# Altium schematic sheet IF_TX.SchDoc: {Наименование}
size 420 x 297 mm; DocumentNumber: ПЛАС.ХХХХХХ.ХХХ ХХ; SheetNumber: {}; SheetTotal: {}; PageSetup: Record=PageOptions|CenterHorizontal=False|CenterVertical=False|PrintScale=0.95|XCorrection=0.00|YCorrection=0.00|PrintKind=1|BorderSize=5000000|LeftOffset=0|BottomOffset=0|Orientation=1|PaperLength=1000|PaperWidth=1000|Scale=100|PaperSource=15|PrintQuality=600|MediaType=1|DitherType=10|PaperKind=A4|PrintScaleMode=1; Rule: PcbType=ProtelPcb
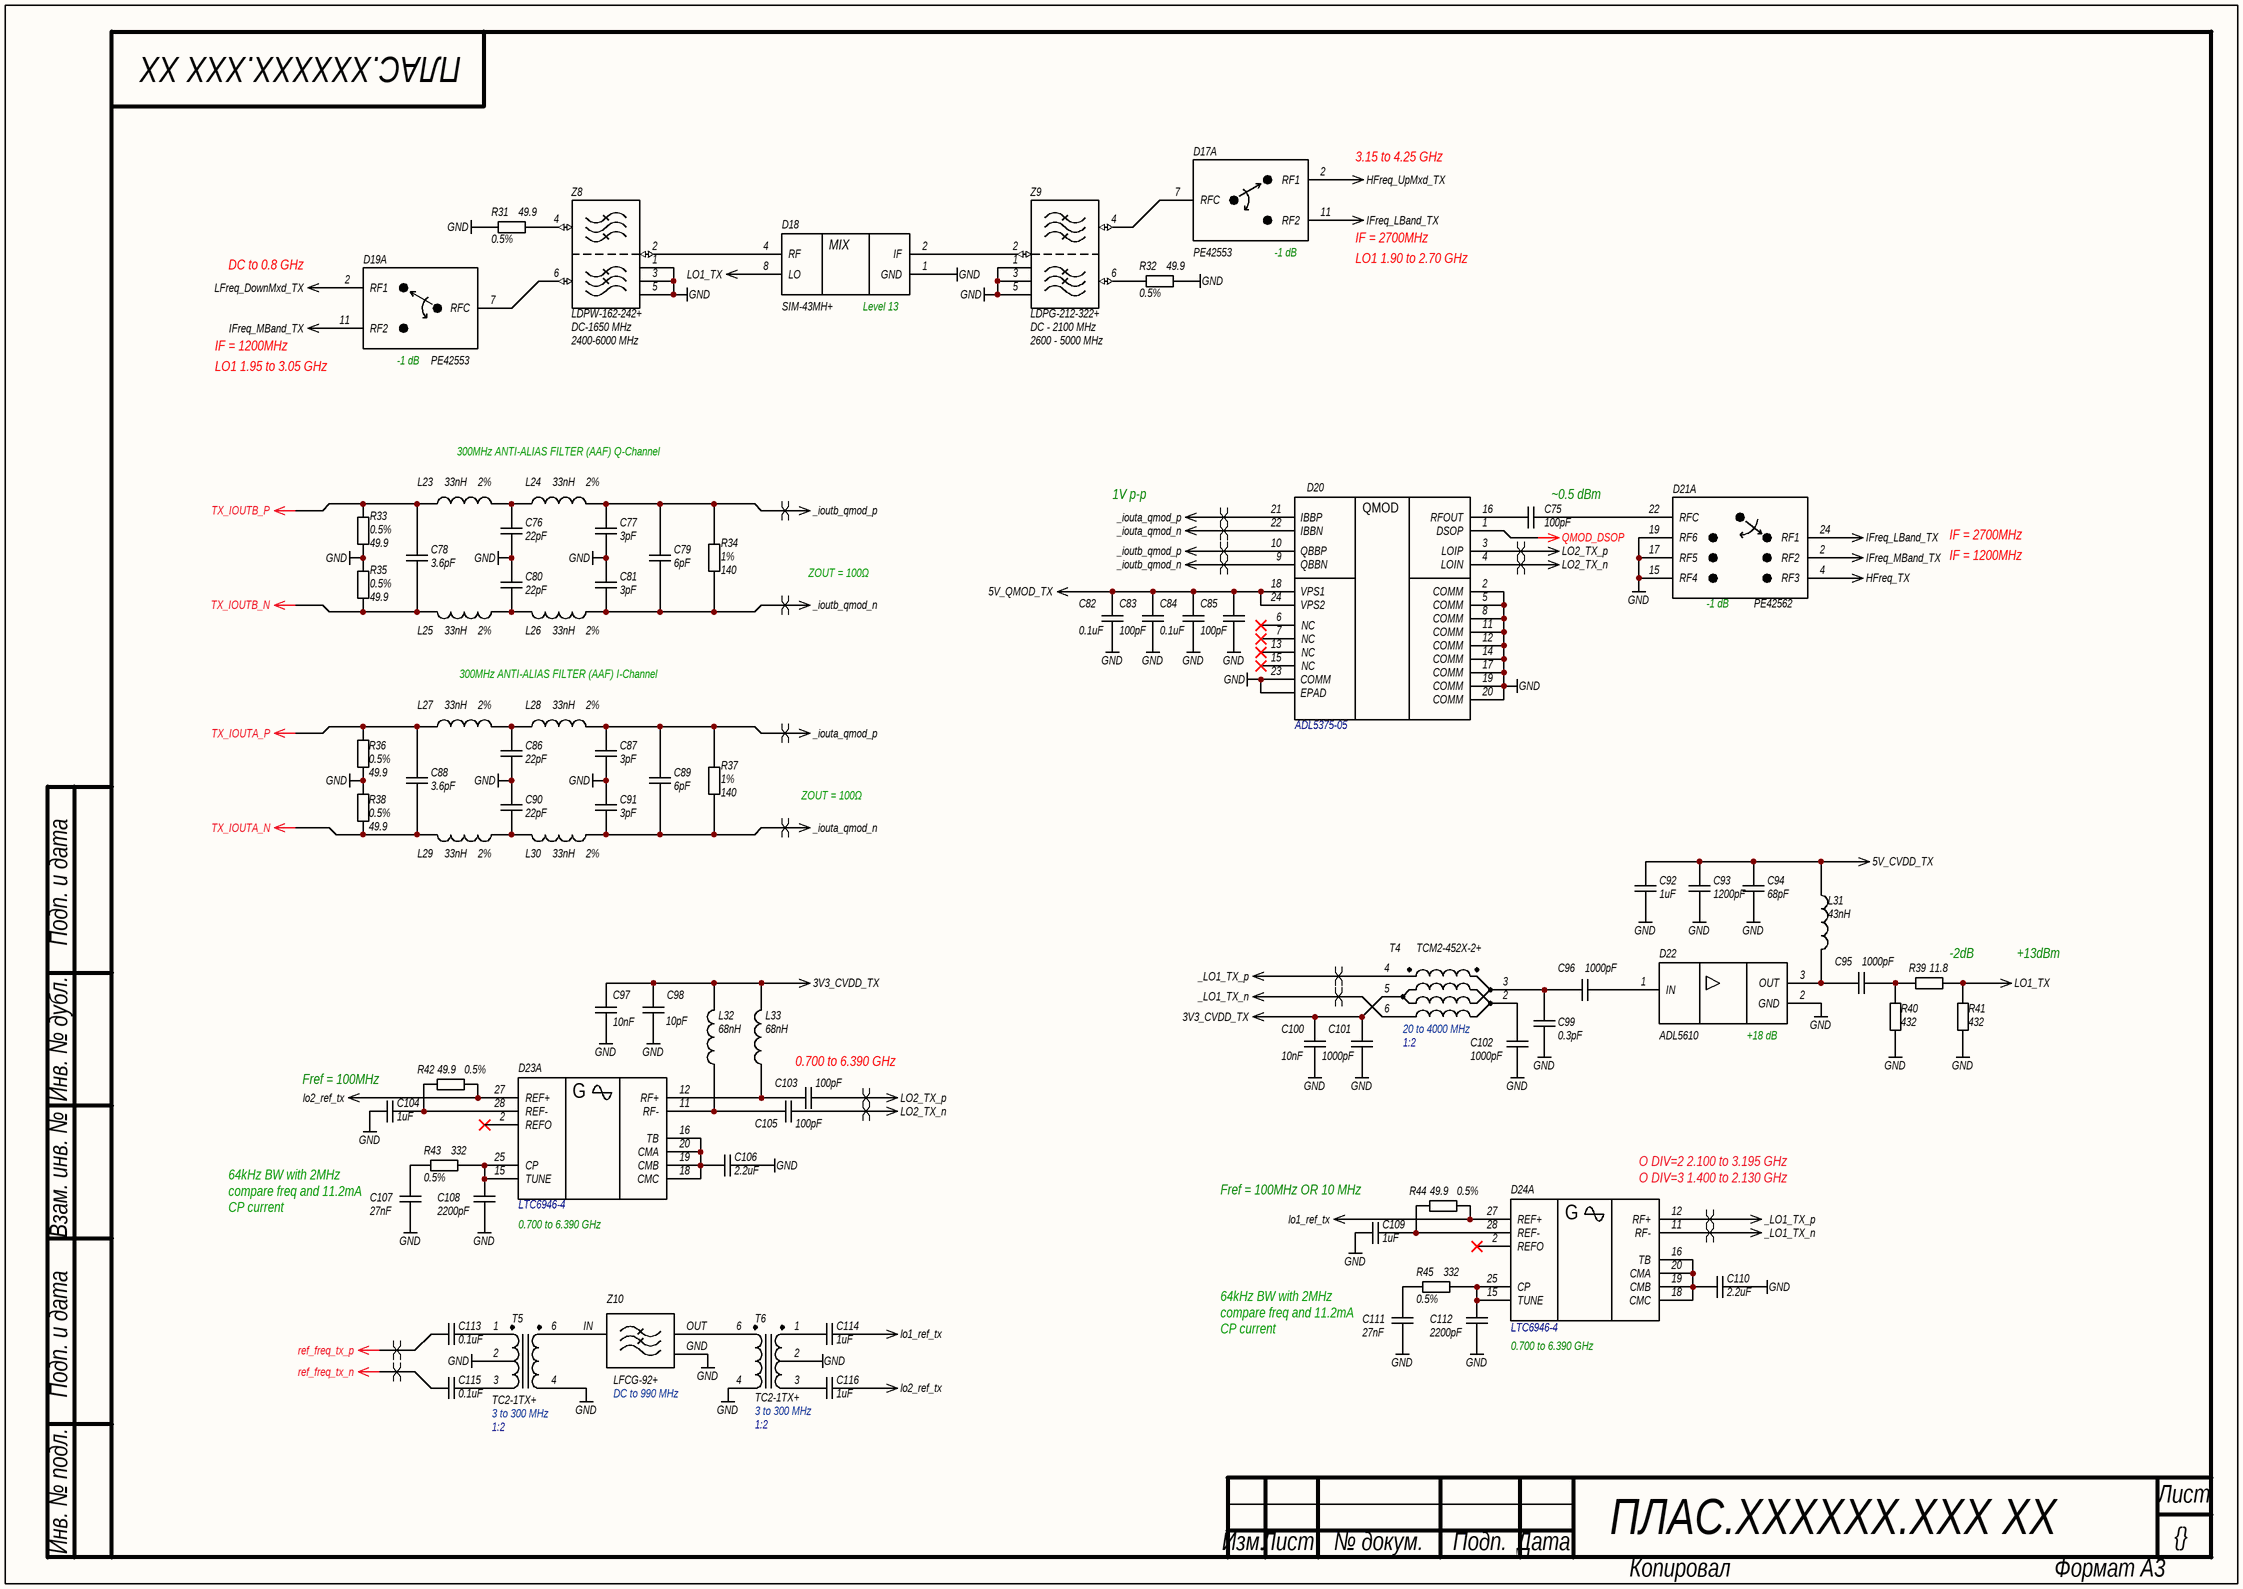
[diagram p0: IF_TX.SchDoc]

## Parts
C75  value 100pF  [C0402]  (hidden comment: CAP)
C76  value 22pF  [C0402]  (hidden comment: CAP)
C77  value 3pF  [C0402]  (hidden comment: CAP)
C78  value 3.6pF  [C0402]  (hidden comment: CAP)
C79  value 6pF  [C0402]  (hidden comment: CAP)
C80  value 22pF  [C0402]  (hidden comment: CAP)
C81  value 3pF  [C0402]  (hidden comment: CAP)
C82  value 0.1uF  [C0402]  (hidden comment: CAP)
C83  value 100pF  [C0402]  (hidden comment: CAP)
C84  value 0.1uF  [C0402]  (hidden comment: CAP)
C85  value 100pF  [C0402]  (hidden comment: CAP)
C86  value 22pF  [C0402]  (hidden comment: CAP)
C87  value 3pF  [C0402]  (hidden comment: CAP)
C88  value 3.6pF  [C0402]  (hidden comment: CAP)
C89  value 6pF  [C0402]  (hidden comment: CAP)
C90  value 22pF  [C0402]  (hidden comment: CAP)
C91  value 3pF  [C0402]  (hidden comment: CAP)
C92  value 1uF  [C0805]  (hidden comment: CAP)
C93  value 1200pF  [C0603]  (hidden comment: CAP)
C94  value 68pF  [C0402]  (hidden comment: CAP)
C95  value 1000pF  [C0402]  (hidden comment: CAP)
C96  value 1000pF  [C0402]  (hidden comment: CAP)
C97  value 10nF  [C0402]  (hidden comment: CAP)
C98  value 10pF  [C0402]  (hidden comment: CAP)
C99  value 0.3pF  [C0402]  (hidden comment: CAP)
C100  value 10nF  [C0402]  (hidden comment: CAP)
C101  value 1000pF  [C0402]  (hidden comment: CAP)
C102  value 1000pF  [C0402]  (hidden comment: CAP)
C103  value 100pF  [C0402]  (hidden comment: CAP)
C104  value 1uF  [C0805]  (hidden comment: CAP)
C105  value 100pF  [C0402]  (hidden comment: CAP)
C106  value 2.2uF  [C0603]  (hidden comment: CAP)
C107  value 27nF  [C1206]  (hidden comment: CAP)
C108  value 2200pF  [C0603]  (hidden comment: CAP)
C109  value 1uF  [C0805]  (hidden comment: CAP)
C110  value 2.2uF  [C0603]  (hidden comment: CAP)
C111  value 27nF  [C1206]  (hidden comment: CAP)
C112  value 2200pF  [C0603]  (hidden comment: CAP)
C113  value 0.1uF  [C0402]  (hidden comment: CAP)
C114  value 1uF  [C0805]  (hidden comment: CAP)
C115  value 0.1uF  [C0402]  (hidden comment: CAP)
C116  value 1uF  [C0805]  (hidden comment: CAP)
D17  PE42553  [QFN-16]  (part A of 2)
D18  SIM-43MH+  [SIM-43MH+]
D19  PE42553  [QFN-16]  (part A of 2)
D20  Name: ADL5375-05  [LFCSP-24]  (hidden comment: ADL5375)
D21  PE42562  [QFN-24]  (part A of 2)
D22  ADL5610  [ADL5610]
D23  Name: LTC6946-4  Frequency Range: 0.700 to 6.390 GHz  [QFN-28]  (hidden comment: LTC6946)  (part A of 2)
D24  Name: LTC6946-4  Frequency Range: 0.700 to 6.390 GHz  [QFN-28]  (hidden comment: LTC6946)  (part A of 2)
L23  value 33nH  Tolerance: 2%  [L0603_HP]  (hidden comment: Inductor RF)
L24  value 33nH  Tolerance: 2%  [L0603_HP]  (hidden comment: Inductor RF)
L25  value 33nH  Tolerance: 2%  [L0603_HP]  (hidden comment: Inductor RF)
L26  value 33nH  Tolerance: 2%  [L0603_HP]  (hidden comment: Inductor RF)
L27  value 33nH  Tolerance: 2%  [L0603_HP]  (hidden comment: Inductor RF)
L28  value 33nH  Tolerance: 2%  [L0603_HP]  (hidden comment: Inductor RF)
L29  value 33nH  Tolerance: 2%  [L0603_HP]  (hidden comment: Inductor RF)
L30  value 33nH  Tolerance: 2%  [L0603_HP]  (hidden comment: Inductor RF)
L31  value 43nH  [L0603_HP]  (hidden comment: Inductor RF)
L32  value 68nH  [L0603_HP]  (hidden comment: Inductor RF)
L33  value 68nH  [L0603_HP]  (hidden comment: Inductor RF)
R31  value 49.9  Tolerance: 0.5%  [R0402]  (hidden comment: RES)
R32  value 49.9  Tolerance: 0.5%  [R0402]  (hidden comment: RES)
R33  value 49.9  Tolerance: 0.5%  [R0402]  (hidden comment: RES)
R34  value 140  Tolerance: 1%  [R0402]  (hidden comment: RES)
R35  value 49.9  Tolerance: 0.5%  [R0402]  (hidden comment: RES)
R36  value 49.9  Tolerance: 0.5%  [R0402]  (hidden comment: RES)
R37  value 140  Tolerance: 1%  [R0402]  (hidden comment: RES)
R38  value 49.9  Tolerance: 0.5%  [R0402]  (hidden comment: RES)
R39  value 11.8  [R0402]  (hidden comment: RES)
R40  value 432  [R0402]  (hidden comment: RES)
R41  value 432  [R0402]  (hidden comment: RES)
R42  value 49.9  Tolerance: 0.5%  [R0402]  (hidden comment: RES)
R43  value 332  Tolerance: 0.5%  [R0603]  (hidden comment: RES)
R44  value 49.9  Tolerance: 0.5%  [R0402]  (hidden comment: RES)
R45  value 332  Tolerance: 0.5%  [R0603]  (hidden comment: RES)
T4  TCM2-452X-2+  Frequency: 20 to 4000 MHz  Ratio: 1:2  [DB1627]
T5  TC2-1TX+  Frequency: 3 to 300 MHz  Ratio: 1:2  [AT1521]
T6  TC2-1TX+  Frequency: 3 to 300 MHz  Ratio: 1:2  [AT1521]
Z8  LDPW-162-242+  Low Pass: DC-1650 MHz  High Pass: 2400-6000 MHz  [JC0603C]
Z9  LDPG-212-322+  Low Pass: DC - 2100 MHz  High Pass: 2600 - 5000 MHz  [GE0805C-10]
Z10  LFCG-92+  Frequency: DC to 990 MHz  [GE0805C-2]

## Nets
3V3_CVDD_TX: C97.2 C98.2 C100.2 C101.1 L32.2 L33.2 T4.5
5V_CVDD_TX: C92.1 C93.2 C94.2 L31.2
5V_QMOD_TX: C82.2 C83.2 C84.2 C85.2 D20.18(VPS1) D20.24(VPS2)
_iouta_qmod_n: C89.2 C91.2 D20.22(IBBN) L30.2 R37.2
_iouta_qmod_p: C87.1 C89.1 D20.21(IBBP) L28.2 R37.1
_ioutb_qmod_n: C79.2 C81.2 D20.9(QBBN) L26.2 R34.2
_ioutb_qmod_p: C77.1 C79.1 D20.10(QBBP) L24.2 R34.1
_LO1_TX_n: D24.11(RF-) T4.6
_LO1_TX_p: D24.12(RF+) T4.4
GND: C76.2 C77.2 C80.1 C81.1 C82.1 C83.1 C84.1 C85.1 C86.2 C87.2 C90.1 C91.1 C92.2 C93.1 C94.1 C97.1 C98.1 C99.1 C100.1 C101.2 C102.2 C104.2 C106.1 C107.1 C108.1 C109.2 C110.1 C111.1 C112.1 D18.1(GND) D20.2(COMM) D20.5(COMM) D20.8(COMM) D20.11(COMM) D20.12(COMM) D20.14(COMM) D20.17(COMM) D20.19(COMM) D20.20(COMM) D20.23(COMM) D20.25(EPAD) D21.15(RF4) D21.17(RF5) D21.19(RF6) D22.2(GND) R31.1 R32.1 R33.2 R35.1 R36.2 R38.1 R40.2 R41.2 T5.2 T5.4 T6.2 T6.4 Z8.1(GND) Z8.3(GND) Z8.5(GND) Z9.1(GND) Z9.3(GND) Z9.5(GND) Z10.GND
HFreq_TX: D21.4(RF3)
HFreq_UpMxd_TX: D17.2(RF1)
IFreq_LBand_TX: D17.11(RF2) D21.24(RF1)
IFreq_MBand_TX: D19.11(RF2) D21.2(RF2)
LFreq_DownMxd_TX: D19.2(RF1)
lo1_ref_tx: C114.1 D24.27(REF+) R44.1
LO1_TX: D18.8(LO) R39.1 R41.1
lo2_ref_tx: C116.1 D23.27(REF+) R42.1
LO2_TX_n: C105.2 D20.4(LOIN)
LO2_TX_p: C103.2 D20.3(LOIP)
QMOD_DSOP: D20.1(DSOP)
ref_freq_tx_n: C115.2
ref_freq_tx_p: C113.2
TX_IOUTA_N: C88.2 L29.1 R38.2
TX_IOUTA_P: C88.1 L27.1 R36.1
TX_IOUTB_N: C78.2 L25.1 R35.2
TX_IOUTB_P: C78.1 L23.1 R33.1
NetC75_1: C75.1 D20.16(RFOUT)
NetC75_2: C75.2 D21.22(RFC)
NetC76_1: C76.1 L23.2 L24.1
NetC80_2: C80.2 L25.2 L26.1
NetC86_1: C86.1 L27.2 L28.1
NetC90_2: C90.2 L29.2 L30.1
NetC95_1: C95.1 D22.3(OUT) L31.1
NetC95_2: C95.2 R39.2 R40.1
NetC96_1: C96.1 C99.2 T4.3
NetC96_2: C96.2 D22.1(IN)
NetC102_1: C102.1 T4.2
NetC103_1: C103.1 D23.12(RF+) L33.1
NetC104_1: C104.1 D23.28(REF-) R42.2
NetC105_1: C105.1 D23.11(RF-) L32.1
NetC106_2: C106.2 D23.16(TB) D23.18(CMC) D23.19(CMB) D23.20(CMA)
NetC107_2: C107.2 R43.2
NetC108_2: C108.2 D23.15(TUNE) D23.25(CP) R43.1
NetC109_1: C109.1 D24.28(REF-) R44.2
NetC110_2: C110.2 D24.16(TB) D24.18(CMC) D24.19(CMB) D24.20(CMA)
NetC111_2: C111.2 R45.2
NetC112_2: C112.2 D24.15(TUNE) D24.25(CP) R45.1
NetC113_1: C113.1 T5.1
NetC114_2: C114.2 T6.1
NetC115_1: C115.1 T5.3
NetC116_2: C116.2 T6.3
NetD17_7: D17.7(RFC) Z9.4
NetD18_2: D18.2(IF) Z9.2
NetD18_4: D18.4(RF) Z8.2
NetD19_7: D19.7(RFC) Z8.6
NetR31_2: R31.2 Z8.4
NetR32_2: R32.2 Z9.6
NetT5_6: T5.6 Z10.IN
NetT6_6: T6.6 Z10.OUT

Not connected (* = marked no-connect by the designer): D20 6(NC)* 7(NC)* 13(NC)* 15(NC)*; D23 2(REFO)*; D24 2(REFO)*

## Layout directives
differential pair: _iouta_qmod_n, _iouta_qmod_p, _ioutb_qmod_n, _ioutb_qmod_p, _LO1_TX_n, _LO1_TX_p, LO2_TX_n, LO2_TX_p, ref_freq_tx_n, ref_freq_tx_p

## Notes on the sheet
- (near D17) 3.15 to 4.25 GHz
- (near D17) IF = 2700MHz
- LO1 1.90 to 2.70 GHz
- (near D19) DC to 0.8 GHz
- IF = 1200MHz
- (near D19) LO1 1.95 to 3.05 GHz
- 300MHz ANTI-ALIAS FILTER (AAF) Q-Channel
- 1V p-p
- (near C75) ~0.5 dBm
- ZOUT = 100Ω
- IF = 2700MHz
- 300MHz ANTI-ALIAS FILTER (AAF) I-Channel
- (near R39) -2dB
- +13dBm
- 0.700 to 6.390 GHz
- (near C104) Fref = 100MHz
- Fref = 100MHz OR 10 MHz
- (near D24) O DIV=2 2.100 to 3.195 GHz
  O DIV=3 1.400 to 2.130 GHz
- 64kHz BW with 2MHz compare freq and 11.2mA CP current
- Подп. и дата
- Инв. № дубл.
- Взам. инв. №
- Инв. № подл.
- Лист
- Изм.
- № докум.
- Подп.
- Дата
- Копировал
- Формат А3
- (in symbol ADL5375) QMOD
- (in symbol ADL5610) +18 dB
- (in symbol LTC6946, part A) G
- (in symbol PE42553, part A) -1 dB
- (in symbol PE42562, part A) -1 dB
- (in symbol SIM-43MH+) MIX; Level 13

## Library data of the parts
C75 C83 C85 C103 C105 = CAP: SMD Capacitor; Manufacturer: Murata; Material: NP0; Tolerance: 1%; Voltage: 50V; Type: Ceramic Capacitor; P/N: GRM1555C1H101FA01D
C76 C80 C86 C90 = CAP: SMD Capacitor; Manufacturer: Murata; Material: NP0; Tolerance: 1%; Voltage: 50V; Type: Ceramic Capacitor; P/N: GRM1555C1H220FA01D
C77 C81 C87 C91 = CAP: SMD Capacitor; Manufacturer: Murata; Material: NP0; Tolerance: ±0.25pF; Voltage: 50V; Type: Ceramic Capacitor; P/N: GRM1555C1H3R0CA01D
C78 C88 = CAP: SMD Capacitor; Manufacturer: Murata; Material: NP0; Tolerance: ±0.25pF; Voltage: 50V; Type: Ceramic Capacitor; P/N: GRM1555C1H3R6CA01D
C79 C89 = CAP: SMD Capacitor; Manufacturer: Murata; Material: NP0; Tolerance: ±0.5pF; Voltage: 50V; Type: Ceramic Capacitor; P/N: GRM1555C1H6R0DA01D
C82 C84 C113 C115 = CAP: SMD Capacitor; Manufacturer: Murata; Material: X7R; Tolerance: 10%; Voltage: 10V; Type: Ceramic Capacitor; P/N: GRM155R71A104KA01J
C92 C104 C109 C114 C116 = CAP: SMD Capacitor; Manufacturer: Murata; Material: X7R; Tolerance: 10%; Voltage: 10V; Type: Ceramic Capacitor; P/N: GRM21BR71A105KA01K
C93 = CAP: SMD Capacitor; Manufacturer: Murata; Material: NP0; Tolerance: ±2%; Voltage: 50V; Type: Ceramic Capacitor; P/N: GRM1885C1H122GA01D
C94 = CAP: SMD Capacitor; Manufacturer: Murata; Material: NP0; Tolerance: ±1%; Voltage: 50V; Type: Ceramic Capacitor; P/N: GRM1555C1H680FA01D
C95 C96 C101 C102 = CAP: SMD Capacitor; Manufacturer: Murata; Material: NP0; Tolerance: 5%; Voltage: 50V; Type: Ceramic Capacitor; P/N: GRM1555C1H102JA01D
C97 C100 = CAP: SMD Capacitor; Manufacturer: Murata; Material: X7R; Tolerance: 10%; Voltage: 25V; Type: Ceramic Capacitor; P/N: GRM155R71E103KA01D
C98 = CAP: SMD Capacitor; Manufacturer: Murata; Material: NP0; Tolerance: 1%; Voltage: 50V; Type: Ceramic Capacitor; P/N: GRM1555C1H100FA01D
C99 = CAP: SMD Capacitor; Manufacturer: Murata; Material: NP0; Tolerance: ±0.05pF; Voltage: 50V; Type: Ceramic Capacitor; P/N: GRM1555C1HR30WA01D
C106 C110 = CAP: SMD Capacitor; Manufacturer: Murata; Material: X7R; Tolerance: 10%; Voltage: 10V; Type: Ceramic Capacitor; P/N: GRM188R71A225KE15J
C107 C111 = CAP: SMD Capacitor; Manufacturer: Murata; Material: NP0; Tolerance: ±5%; Voltage: 50V; Type: Ceramic Capacitor; P/N: GRM3195C1H273JA01D
C108 C112 = CAP: SMD Capacitor; Manufacturer: Murata; Material: NP0; Tolerance: 1%; Voltage: 50V; Type: Ceramic Capacitor; P/N: GRM1885C1H222FA01D
D17 D19 = PE42553: HaRPTM technology-enhanced absorptive SPDT; Manufacturer: Peregrine Technical Solutions; P/N: PE42553A-Z; Type: SPDT RF Switch; Name: PE42553; Package: 16-lead 3 × 3 mm QFN; Supplier 1: Digi-Key; Supplier Part Number 1: 1046-1137-1-ND
D18 = SIM-43MH+: Frequency Mixer; Manufacturer: Mini-Circuits; Power Level: +13dBm; Name: SIM-43MH+; Package: HV1195; Type: Frequency Mixer; P/N: SIM-43MH+
D20 = ADL5375: Broadband Quadrature Modulator; Manufacturer: Analog Devices; Voltage: 4.75 V to 5.25 V; P/N: ADL5375-05SCPZEPR7; Package: 24-lead LFCSP_VQ package; Temperature Range: –40°C to 125°C; Type: Broadband Quadrature Modulator; Supplier 1: Digi-Key; Supplier Part Number 1: ADL5375-05ACPZ-R7CT-ND
D21 = PE42562: The PE42582 is a HaRP™ technology-enhanced absorptive SP6T RF switch; Manufacturer: Peregrine Technical Solutions; P/N: PE42562A-X; Name: PE42562; Package: 24-lead 4 × 4 × 0.85 mm QFN; Type: Absorptive SP6T RF switch
D22 = ADL5610: RF/IF Gain Block; Manufacturer: Analog Devices; P/N: ADL5610ARKZ-R7; Name: ADL5610; Package: SOT89; Type: RF/IF Gain Block; Supplier 1: Digi-Key; Supplier Part Number 1: ADL5610ARKZ-R7CT-ND
D23 D24 = LTC6946: The LTC®6946 is a high performance, low noise, 6.39GHz  phase-locked loop (PLL); Manufacturer: Linear Technology; Voltage: 3.15 V ~ 5.25 V; Type: Clock/Frequency Synthesizer (RF/IF), Integer N; P/N: LTC6946IUFD-4#PBF; Package: 28-QFN (4x5); Temperature Range: -40°C ~ 105°C; Supplier 1: Digi-Key; Supplier Part Number 1: LTC6946IUFD-4#PBF-ND
L23-L30 = Inductor RF: Chip SMD Inductor; Manufacturer: Coilcraft; Current: 680mA; Frequency: 2.70GHz; Name: 0603HP-33NXGE; Series: 0603HP; Temperature Range: -25…85°C; P/N: 0603HP-33NXGE
L31 = Inductor RF: Chip SMD Inductor; Manufacturer: Coilcraft; Current: 810mA; Frequency: 2.45GHz; Name: 0603HP-43NXJE; Tolerance: 5%; Series: 0603HP; Temperature Range: -25…85°C; P/N: 0603HP-43NXJE
L32 L33 = Inductor RF: Chip SMD Inductor; Manufacturer: Coilcraft; Current: 600mA; Frequency: 2.00GHz; Name: 0603HP-68NXJE; Tolerance: 5%; Series: 0603HP; Temperature Range: -25…85°C; P/N: 0603HP-68NXJE
R31-R33 R35 R36 R38 R42 R44 = RES: SMD Resistor; Manufacturer: Panasonic Electronic Components; Name: Chip SMD Resistor; Power: 0.063 Wt; P/N: ERJ-2RKD49R9X; Temperature Range: -55…155°C
R34 R37 = RES: SMD Resistor; Manufacturer: Panasonic Electronic Components; Name: Chip SMD Resistor; Power: 0.1 Wt; P/N: ERJ-2RKF1400X; Temperature Range: -55…155°C
R39 = RES: SMD Resistor; Manufacturer: Panasonic Electronic Components; Name: Chip SMD Resistor; Power: 0.063 Wt; Tolerance: ±1%; P/N: ERJ-2RKF11R8X; Temperature Range: -55…155°C
R40 R41 = RES: SMD Resistor; Manufacturer: Panasonic Electronic Components; Name: Chip SMD Resistor; Power: 0.1 Wt; Tolerance: ±1%; P/N: ERJ-2RKF4320X; Temperature Range: -55…155°C
R43 R45 = RES: SMD Resistor; Manufacturer: Panasonic Electronic Components; Name: Chip SMD Resistor; Power: 0.2 Wt; P/N: ERJ-PB3D3320V; Temperature Range: -55…155°C
T4 = TCM2-452X-2+: RF Transformer; Manufacturer: Mini-Circuits; Name: TCM2-452X-2+; P/N: TCM2-452X-2+; Type: RF Transformer; Package: DB1627
T5 T6 = TC2-1TX+: RF Transformer; Manufacturer: Mini-Circuits; Name: TC2-1TX+; P/N: TC2-1TX+; Type: RF Transformer; Package: AT1521
Z8 = LDPW-162-242+: Diplexer; Manufacturer: Mini-Circuits; Frequency: DC to 6000 MHz; Name: LDPW-162-242+; P/N: LDPW-162-242+; Type: Diplexer; Package: JC0603C
Z9 = LDPG-212-322+: Diplexer; Manufacturer: Mini-Circuits; Frequency: DC to 5000 MHz; Name: LDPG-212-322+; P/N: LDPG-212-322+; Type: Diplexer; Package: GE0805C-10
Z10 = LFCG-92+: Low Pass Filter; Manufacturer: Mini-Circuits; Name: LFCG-92+; P/N: LFCG-92+; Type: Low Pass Filter; Package: GE0805C-2